# Altium project testeur.PrjPcb
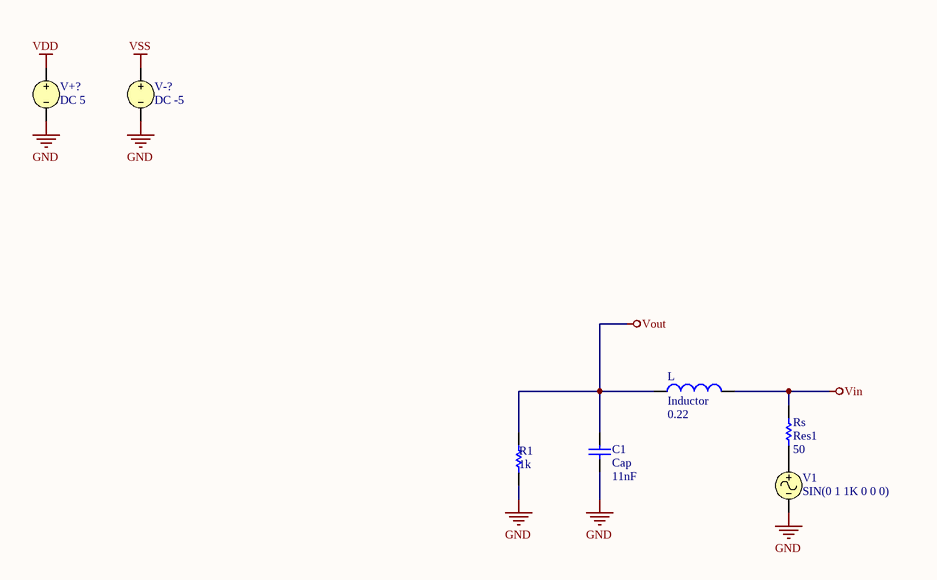
[diagram p0: Sheet2.SchDoc]
1 sheet, 7 parts. Net scope: global (net labels, ports and power ports of the same name join across sheets).

## Sheet Sheet2.SchDoc
size A4; SheetNumber: 1; SheetTotal: 1; SPICEModelCacheCGGSEKNX: <root> / <DocumentId>CGGSEKNX</DocumentId> / </root>

### Parts
C1  Cap  value 11nF  [RAD-0.3]
L  Inductor  value 0.22  [0402-A]
R1  value 1k  [AXIAL-0.3]  (hidden comment: Res1)
Rs  Res1  value 50  [AXIAL-0.3]
V1  SIN(0 1 1K 0 0 0)
V+?  DC 5
V-?  DC -5

### Nets
GND: C1.2 R1.1 V1.2 V+?.2 V-?.2
VDD: V+?.1
Vin: L.2 Rs.2
Vout: C1.1 L.1 R1.2
VSS: V-?.1
NetRs_1: Rs.1 V1.1

### Library data of the parts
C1 = Cap: Capacitor; Published: 8-Jun-2000; LatestRevisionDate: 17-Jul-2002; LatestRevisionNote: Re-released for DXP Platform.; PackageReference: RAD-0.3; Publisher: Altium Limited; PackageDescription: Radial Cap, Thru-Hole; 2 Leads; 0.3 in Pin Spacing
L = Inductor: Code_IEC: 1005; Published: 8-Jun-2000; LatestRevisionDate: 29-May-2009; LatestRevisionNote: IPC-7351 Footprint Added.; PackageReference: 0402-A; Publisher: Altium Limited; PackageDescription: Chip Inductor; Code_JEITA: 0402
R1 Rs = Res1: Resistor; Published: 8-Jun-2000; LatestRevisionDate: 17-Jul-2002; LatestRevisionNote: Re-released for DXP Platform.; PackageReference: AXIAL-0.3; Publisher: Altium Limited; PackageDescription: Axial Device, Thru-Hole; 2 Leads; 0.3 in Pin Spacing
V1 = VSIN: Sinusoidal Voltage Source; Note: PCB Footprint - Not required; Offset: 0; Amplitude: 1; Published: 8-Jun-2000; LatestRevisionDate: 15-Nov-2004; LatestRevisionNote: Corrected Netlist.; PackageReference: Not Applicable; Publisher: Altium Limited; Frequency: 1K; Delay: 0; Damping Factor: 0; Phase: 0; DC Magnitude: 0; AC Magnitude: 1; AC Phase: 0
V+? = VSRC: Voltage Source; Note: PCB Footprint - Not required; Value: 5; Published: 8-Jun-2000; LatestRevisionDate: 17-Jul-2002; LatestRevisionNote: Re-released for DXP Platform.; PackageReference: Not Applicable; Publisher: Altium Limited
V-? = VSRC: Voltage Source; Note: PCB Footprint - Not required; Published: 8-Jun-2000; LatestRevisionDate: 17-Jul-2002; LatestRevisionNote: Re-released for DXP Platform.; PackageReference: Not Applicable; Publisher: Altium Limited; Value: -5